# EAGLE design deBug (EAGLE 6.5.0)
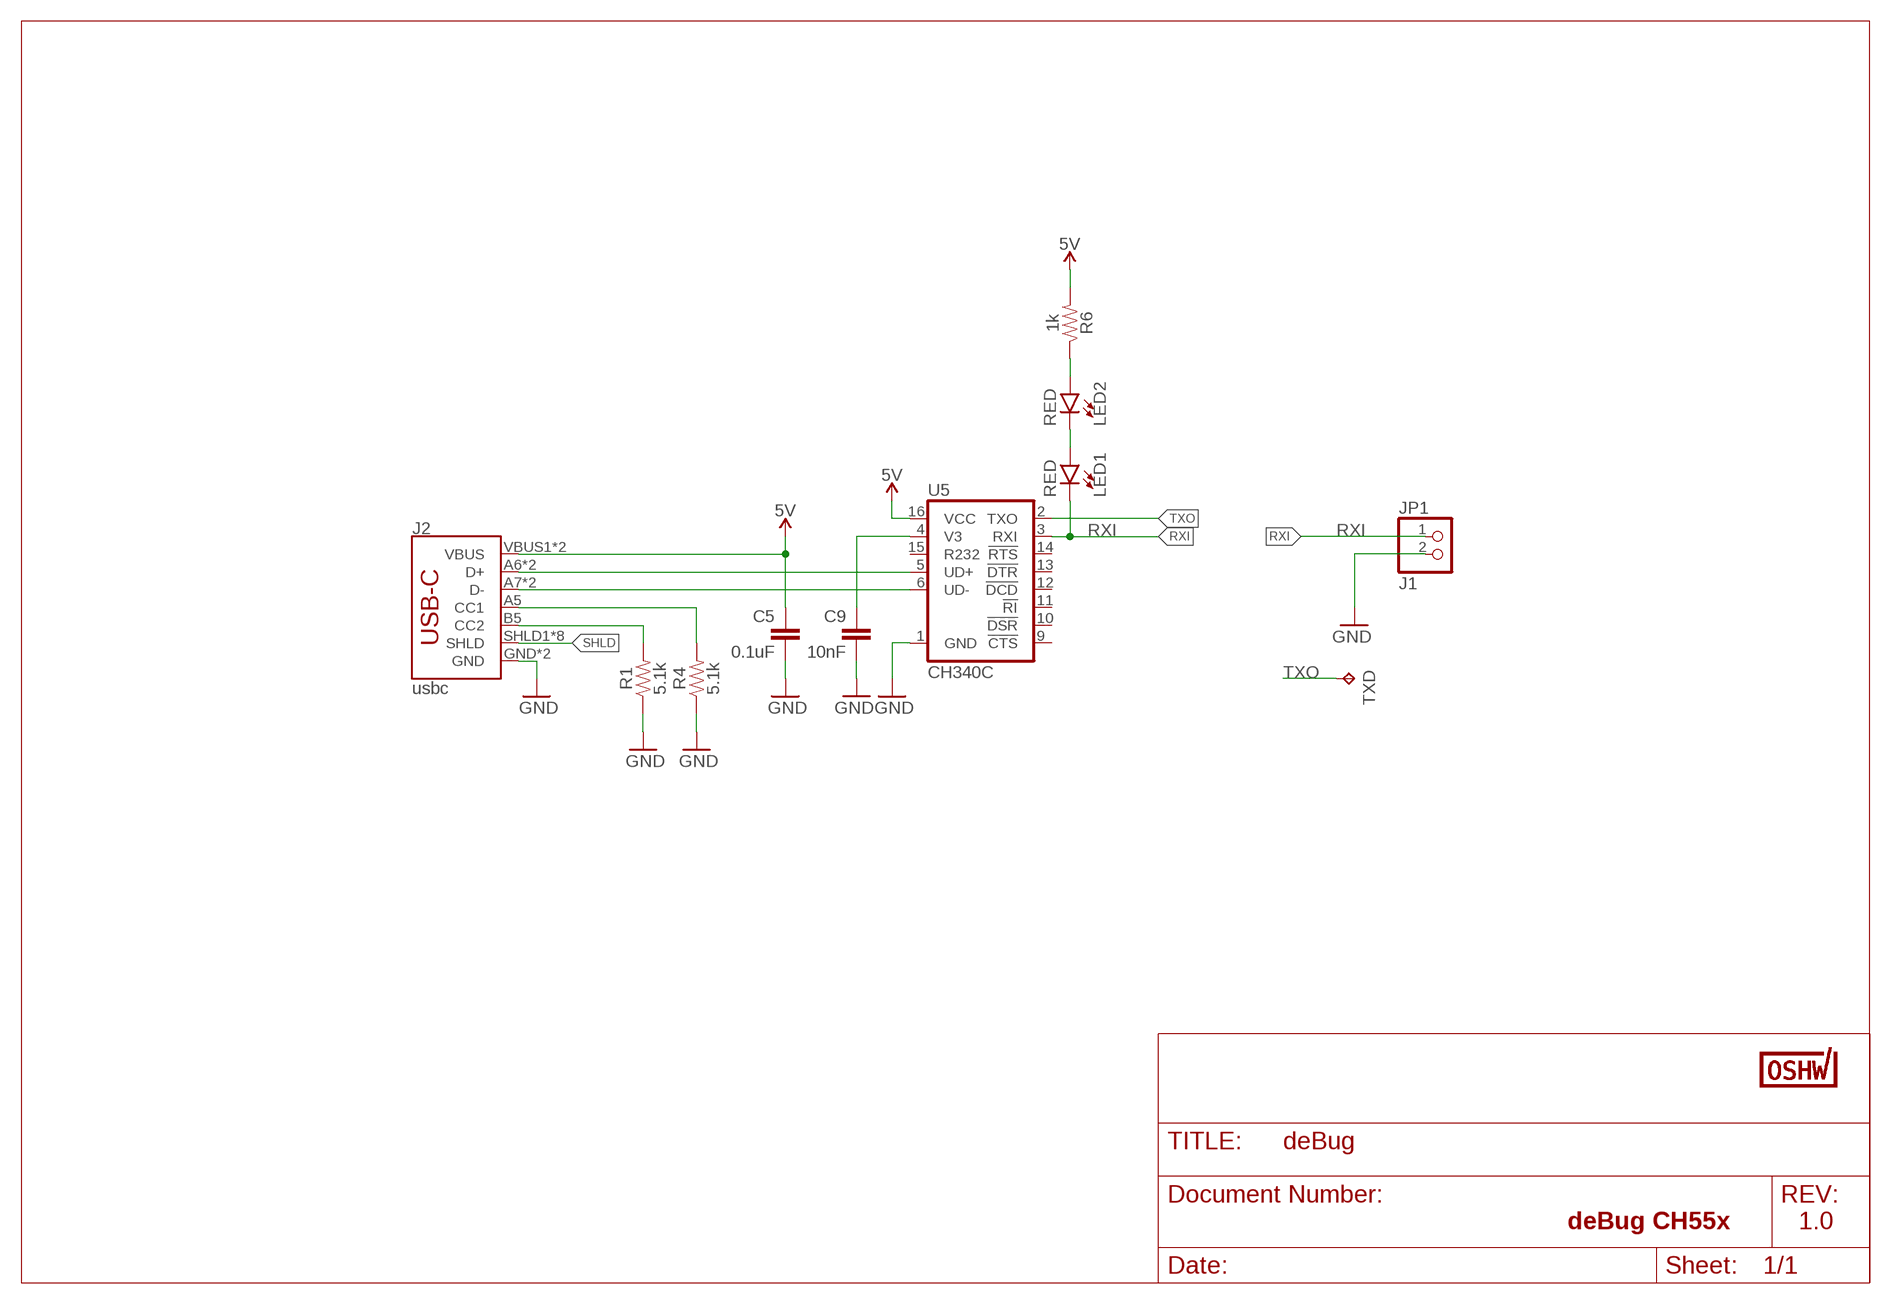
[diagram p0: schematic, sheet 1]

## Parts
C5  0.1uF  0.1UF-0603-25V-(+80/-20%)  [0603]
C9  10nF  10NF-0603-50V-10%  [0603]
J2  usbc  USB_C16PIN  [USB-C-16P]
JP1  J1  PINHD-1X2  [1X02]
LED1  RED  LED-GREEN0603  [LED-0603]
LED2  RED  LED-GREEN0603  [LED-0603]
R1  5.1k  5.1KOHM5.1KOHM-0603-1/10W-1%  [0603]
R4  5.1k  5.1KOHM5.1KOHM-0603-1/10W-1%  [0603]
R6  1k  1KOHM-0603-1/10W-1%  [0603]
TXD  TPB1,27  [B1,27]
U5  CH340C  [SO016]
U$2  CERT-LARGE  [CERT-LARGE-SILK]

## Nets
5V: C5.1 J2.VBUS1(VBUS) J2.VBUS2(VBUS) R6.2 U5.16(VCC)
CC1: J2.A5(CC1) R4.2
CC2: J2.B5(CC2) R1.2
D+: J2.A6(D+) J2.B6(D+) U5.5(UD+)
D-: J2.A7(D-) J2.B7(D-) U5.6(UD-)
GND [power]: C5.2 C9.2 J2.GND J2.GND2(GND) JP1.2 R1.1 R4.1 U5.1(GND)
N$1: C9.1 U5.4(V3)
N$3: LED2.A R6.1
N$4: LED1.A LED2.C
RXI: JP1.1 LED1.C U5.3(RXI)
SHLD: J2.SHLD1(SHLD) J2.SHLD2(SHLD) J2.SHLD3(SHLD) J2.SHLD4(SHLD) J2.SHLD5(SHLD) J2.SHLD6(SHLD) J2.SHLD7(SHLD) J2.SHLD8(SHLD)
TXO: TXD.TP U5.2(TXO)
Unconnected: U5.9(!CTS) U5.10(!DSR) U5.11(!RI) U5.12(!DCD) U5.13(!DTR) U5.14(!RTS) U5.15(R232)

## Notes on the sheet
- deBug CH55x | 1.0

## Library data of the parts
C5 = SparkFun-Capacitors:0.1UF: 0.1µF ceramic capacitors A capacitor is a passive two-terminal electrical component used to store electrical energy temporarily in an electric field.; PROD_ID: CAP-00810
C9 = SparkFun-Capacitors:10NF: 0.01uF/10nF/10,000pF ceramic capacitors A capacitor is a passive two-terminal electrical component used to store electrical energy temporarily in an electric field. CAP-09321; PROD_ID: CAP-00867
J2 = SparkFun-Connectors:USB_C: USB Type C 16Pin Connector Super Speed pins not available on the 16-pin purely SMD connector so this part is best for USB 2.0 implementations. D1 and D2 are tied together enabling D+/- no matter which way the cable is plugged into the connector. The two channel configuration pins (CC1/2) are exposed. These are normally connected to ground via 5.1k resistors but can be reconfigured for high current/high power applications.; PROD_ID: CONN-14122
JP1 = pinhead:PINHD-1X2: PIN HEADER
LED1 LED2 = SparkFun-LED:LED-GREEN: Green SMD LED Used in manufacturing of various products at SparkFun Packages: 0603 - SMD 0603 package [Product Link] <http://www.futureelectronics.com/en/technologies/semiconductors/optoelectronics/leds/Pages/9894312-LTST-C190GKT.aspx?CrossPart=HSMG-C190&IM=0> LilyPad 1206 - SMD1206 LilyPad package [Product Link] <http://www.futureelectronics.com/en/Technologies/Product.aspx?ProductID=IN150NGHARVATEKCORPORATION2049943&IM=0> 1206 - SMD1206 package [Product Link] <http://www.futureelectronics.com/en/technologies/semiconductors/optoelectronics/leds/Pages/8315665-LTST-C150KGKT.aspx?IM=0> 1206 Bottom Mount -SMD 1206 Bottom Mount [Product Link] <http://www.digikey.com/product-detail/en/lite-on-inc/LTST-C230KGKT/160-1456-1-ND/386854> SparkFun Products: Pro Mini 328 -5V <https://www.sparkfun.com/products/821> RedBoard <https://www.sparkfun.com/products/12757> MP3 Trigger <https://www.sparkfun.com/products/13720> Makey Makey <https://www.sparkfun.com/products/11076>; PROD_ID: DIO-00821; VALUE: GREEN
R1 R4 = SparkFun-Resistors:5.1KOHM; PROD_ID: RES-12083
R6 = SparkFun-Resistors:1KOHM: 1kΩ resistor A resistor is a passive two-terminal electrical component that implements electrical resistance as a circuit element. Resistors act to reduce current flow, and, at the same time, act to lower voltage levels within circuits. - Wikipedia; PROD_ID: RES-07856
TXD = testpad:TP: Test pad
U5 = SparkFun-IC-Comms:CH340C; PROD_ID: IC-14038
U$2 = OSHWA:CERT

## Net classes
1 power: width 0.178 mm

## Board
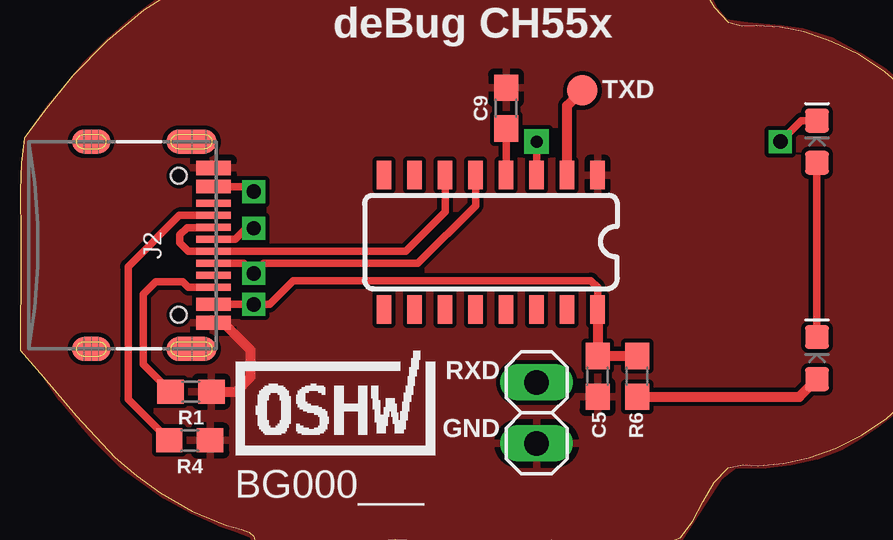
[diagram p1: board, top side]
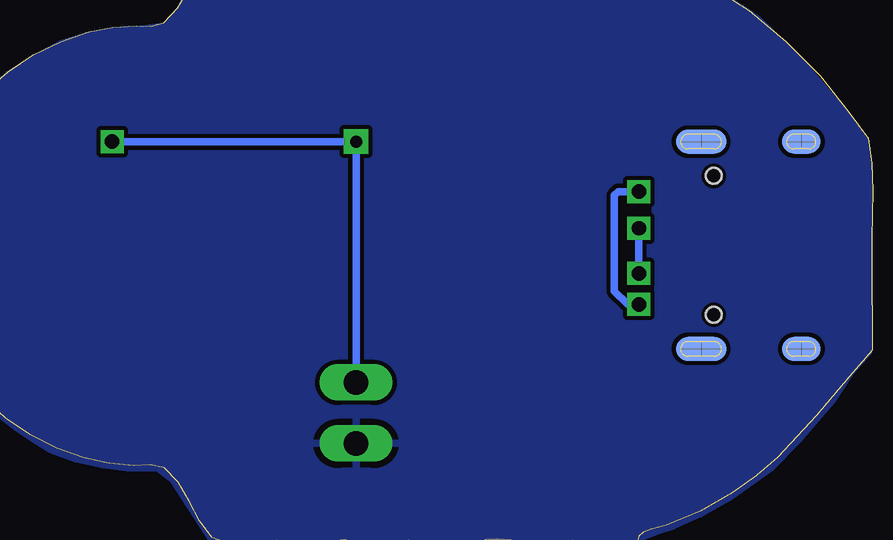
[diagram p2: board, bottom side, seen from below]

No outline drawn. Coordinates in mm, seen from the top.
Copper layers (1*16): Top 0.035mm / dielectric 1.5mm / Bottom 0.035mm
Design rules "SparkFun-2-layer-TIGHT *": minimum track width 7mil, minimum drill 15mil, track to track 7mil, track to pad 7mil, pad to pad 7mil, via to via 7mil, smd to smd 7mil, copper to edge 7mil, drill to drill 7mil, minimum pad ring 7mil, minimum via ring 7mil, stop-mask expansion 4mil, vias tented up to drill 25mil, thermal gap 10mil
Holes 2.8 mm at 48.39,32.64
Milling: 319 lines

### Footprints (pad centres in the part's own frame; a part is rotated, then mirrored left to right if it is on the bottom)
0603 = smd 1.1 x 1: 1 -0.85,0; 2 0.85,0
USB-C-16P = smd 0.3 x 1.45: A5 -1.25,0; A6 -0.25,0; A7 0.25,0; A8 1.25,0; B5 1.75,0; B6 0.75,0; B7 -0.75,0; B8 -1.75,0 | smd 0.6 x 1.45: GND -3.225,0; GND2 3.225,0 | smd 1 x 2.1: SHLD1 -4.32,-0.915; SHLD2 4.32,-0.915 | smd 1 x 2.1 bottom: SHLD3 -4.32,-0.915; SHLD4 4.32,-0.915 | smd 1 x 1.6: SHLD5 -4.32,-5.095; SHLD8 4.32,-5.095 | smd 1 x 1.6 bottom: SHLD6 -4.32,-5.095; SHLD7 4.32,-5.095 | smd 0.55 x 1.45: VBUS1 -2.45,0; VBUS2 2.45,0 | hole 0.65: -2.89,-1.445; 2.89,-1.445
1X02 = drill 1.016 long: 1 -1.27,0; 2 1.27,0
LED-0603 = smd 1 x 1: A -0.877,0; C 0.877,0
B1,27 = smd 1.27 x 1.27: TP 0,0
SO016 = smd 0.6 x 1.2: 1 -4.445,-2.8; 2 -3.175,-2.8; 3 -1.905,-2.8; 4 -0.635,-2.8; 5 0.635,-2.8; 6 1.905,-2.8; 7 3.175,-2.8; 8 4.445,-2.8; 9 4.445,2.8; 10 3.175,2.8; 11 1.905,2.8; 12 0.635,2.8; 13 -0.635,2.8; 14 -1.905,2.8; 15 -3.175,2.8; 16 -4.445,2.8

### Placement (x,y rotation side)
C5  34.04,27.18 270 top
C9  30.23,38.35 90 top
J2  18.03,32.64 270 top
JP1  31.5,25.65 270 top
LED1  43.18,36.96 90 top
LED2  43.18,27.94 90 top
R1  17.09,26.54 180 top
R4  17.04,24.51 180 top
R6  35.69,27.18 90 top
TXD  33.4,39.09 0 top
U5  29.59,32.77 180 top
U$1  [CERT-SMALL-SILK]  23.11,23.9 0 top
U$2  8.05,-27.99 0 top

### Tracks (layer width: path | path; a pad name or v marks a point on that pad's centre or on a via)
5V  (via drill 0.6)
  Top 0.305: J2.VBUS1 18.05,35.08 19.51,35.08 v19.71,34.87 | U5.16 34.04,30.89 33.76,31.17 21.36,31.17 20.37,30.18 v19.71,30.18 19.7,30.19 J2.VBUS2
  Top 0.406: U5.16 C5.1 R6.2
  Bottom 0.305: v19.71,30.18 20.17,30.18 20.73,30.73 20.73,34.72 20.57,34.87 v19.71,34.87
CC1
  Top 0.305: J2.A5 16.62,33.89 14.48,31.75 14.48,26.23 R4.2
CC2
  Top 0.305: J2.B5 16.99,30.89 16.76,31.11 15.62,31.11 15.11,30.61 15.11,27.67 R1.2
D+  (via drill 0.6)
  Top 0.305: U5.5 28.96,34.29 26.55,31.89 20.13,31.89 v19.71,31.47 19.29,31.89 J2.B6 | v19.71,33.35 19.41,33.35 18.95,32.89 J2.A6
  Bottom 0.305: v19.71,31.47 v19.71,33.35
D-
  Top 0.305: U5.6 27.69,34.04 26.04,32.39 J2.A7 16.99,32.39 16.64,32.74 16.64,33.07 16.94,33.38 18.02,33.38 J2.B7
GND
  Top 0.406: J2.GND2 18.44,29.41 19.58,28.27 19.58,27.15 18.97,26.54 R1.1
  pour Top: 19.43,44.58 18.03,44.07 16.26,43.18 14.73,42.04 13.72,41.15 12.7,40.13 11.3,38.48 10.29,37.08 10.16,35.81 10.16,28.32 10.92,27.43 11.68,26.29 12.45,25.4 13.08,24.64 14.22,23.5 16,22.23 17.14,21.59 18.29,21.08 19.05,20.83 19.68,20.57 19.81,20.19 19.81,19.68 19.68,18.41 19.68,18.03 19.18,17.91 17.4,18.03 16.26,17.78 15.49,17.27 11.56,13.08 11.3,12.57 11.3,12.06 11.43,11.68 11.81,11.43 12.32,11.3 12.83,11.43 13.34,11.68 17.14,15.49 17.78,15.62 21.97,15.62 22.1,16.51 22.1,20.07 22.35,20.32 26.16,20.32 26.54,20.19 26.54,17.02 26.42,16.51 22.1,11.81 21.72,11.05 21.72,10.41 22.1,10.03 22.73,9.78 23.37,10.03 28.7,15.62 28.83,16.51 28.83,19.68 28.96,20.32 30.99,20.19 32.26,20.32 32.13,17.53 32.13,16.13 37.59,12.57 38.35,12.32 38.99,12.32 39.37,12.83 39.5,13.46 39.24,14.1 38.61,14.61 34.42,17.27 34.42,20.07 34.8,20.32 36.96,20.32 37.47,20.45 39.12,22.99 39.75,23.5 41.02,23.5 42.04,23.62 43.18,23.88 44.2,24.26 44.83,24.64 45.59,25.15 47.24,26.42 48.26,27.56 48.77,28.19 49.4,28.19 51.69,27.18 53.59,26.04 54.99,24.89 56.13,23.37 56.9,21.84 57.53,21.08 58.04,20.95 58.42,20.95 58.93,21.21 59.05,21.59 59.05,22.23 58.29,23.75 57.28,25.15 56.39,26.16 55.37,27.18 54.23,28.07 52.45,29.08 49.91,30.1 50.67,31.37 50.93,31.88 51.05,32.64 50.93,33.4 50.42,34.42 49.91,35.18 52.07,35.94 53.47,36.7 55.12,37.85 56.26,38.86 57.02,39.75 57.91,40.77 58.55,41.78 58.93,42.67 59.05,43.31 59.05,43.69 58.8,44.07 58.29,44.32 57.91,44.32 57.53,44.07 56.9,43.43 56.01,41.78 54.74,40.26 53.47,38.99 51.69,38.1 50.55,37.59 49.28,37.08 48.77,37.08 48.26,37.59 47.12,38.86 46.86,39.12 45.97,39.88 44.96,40.51 43.81,41.15 42.55,41.53 41.66,41.66 40.26,41.78 39.37,41.91 38.86,42.55 38.1,44.07 37.34,44.83 36.96,44.96 34.42,44.96 34.29,45.34 34.29,45.97 34.42,47.62 34.67,48.13 36.07,49.02 38.99,50.8 39.37,51.31 39.5,52.07 39.24,52.58 38.73,52.83 38.1,52.83 37.72,52.7 32.26,49.15 32.13,48.26 32.13,44.96 28.96,44.96 28.7,45.34 28.83,49.15 28.57,49.91 23.37,55.24 22.86,55.37 22.35,55.37 21.72,54.74 21.72,54.1 22.1,53.21 26.54,48.64 26.54,45.21 26.42,44.96 26.04,44.83 22.61,44.83 22.1,45.09 21.97,45.59 21.97,49.53 17.27,49.53 12.95,53.85 12.19,53.85 11.56,53.59 11.3,53.09 11.3,52.45 11.68,51.94 15.24,48.39 16,47.5 16.64,47.24 19.68,47.24 19.81,46.86 19.81,44.83
  pour Bottom: 19.43,44.45 18.03,43.94 16.26,43.05 14.73,42.04 12.7,40.01 11.3,38.35 10.29,36.96 10.16,35.69 10.16,28.19 10.92,27.3 11.68,26.16 12.45,25.27 13.08,24.51 14.22,23.37 16,22.1 17.14,21.46 18.29,20.95 19.05,20.7 19.68,20.45 19.81,20.07 19.81,19.56 19.68,18.29 19.68,17.91 19.18,17.78 17.4,17.91 16.26,17.65 15.49,17.14 11.56,12.95 11.3,12.45 11.3,11.94 11.43,11.56 11.81,11.3 12.32,11.18 12.83,11.3 13.34,11.56 17.14,15.37 17.78,15.49 21.97,15.49 22.1,16.38 22.1,19.94 22.35,20.19 26.16,20.19 26.54,20.07 26.54,16.89 26.42,16.38 22.1,11.68 21.72,10.92 21.72,10.29 22.1,9.91 22.73,9.65 23.37,9.91 28.7,15.49 28.83,16.38 28.83,19.56 28.96,20.19 30.99,20.07 32.26,20.19 32.13,17.4 32.13,16 37.59,12.45 38.35,12.19 38.99,12.19 39.37,12.7 39.5,13.34 39.24,13.97 38.61,14.48 34.42,17.14 34.42,19.94 34.8,20.19 36.96,20.19 37.47,20.32 39.12,22.86 39.75,23.37 41.02,23.37 42.04,23.5 43.18,23.75 44.2,24.13 44.83,24.51 45.59,25.02 47.24,26.29 48.26,27.43 48.77,28.07 49.4,28.07 51.69,27.05 53.59,25.91 54.99,24.77 56.13,23.24 56.9,21.72 57.53,20.95 58.04,20.83 58.42,20.83 58.93,21.08 59.05,21.46 59.05,22.1 58.29,23.62 57.28,25.02 56.39,26.04 55.37,27.05 54.23,27.94 52.45,28.96 49.91,29.97 50.67,31.24 50.93,31.75 51.05,32.51 50.93,33.27 50.42,34.29 49.91,35.05 52.07,35.81 53.47,36.58 55.12,37.72 56.26,38.73 57.02,39.62 57.91,40.64 58.55,41.66 58.93,42.55 59.05,43.18 59.05,43.56 58.8,43.94 58.29,44.2 57.91,44.2 57.53,43.94 56.9,43.31 56.01,41.66 54.74,40.13 53.47,38.86 51.69,37.97 50.55,37.47 49.28,36.96 48.77,36.96 48.26,37.47 47.12,38.73 46.86,38.99 45.97,39.75 44.96,40.39 43.81,41.02 42.55,41.4 41.66,41.53 40.26,41.66 39.37,41.78 38.86,42.42 38.1,43.94 37.34,44.7 36.96,44.83 34.42,44.83 34.29,45.21 34.29,45.85 34.42,47.5 34.67,48.01 36.07,48.9 38.99,50.67 39.37,51.18 39.5,51.94 39.24,52.45 38.73,52.7 38.1,52.7 37.72,52.58 32.26,49.02 32.13,48.13 32.13,44.83 28.96,44.83 28.7,45.21 28.83,49.02 28.57,49.78 23.37,55.12 22.86,55.24 22.35,55.24 21.72,54.61 21.72,53.98 22.1,53.09 26.54,48.51 26.54,45.09 26.42,44.83 26.04,44.7 22.61,44.7 22.1,44.96 21.97,45.47 21.97,49.4 17.27,49.4 12.95,53.72 12.19,53.72 11.56,53.47 11.3,52.96 11.3,52.32 11.68,51.82 15.24,48.26 16,47.37 16.64,47.12 19.68,47.12 19.81,46.74 19.81,44.7
N$1
  Top 0.305: C9.1 U5.4
N$3
  Top 0.406: R6.1 42.45,26.33 LED2.A
N$4
  Top 0.305: LED2.C LED1.A
RXI  (via drill 0.5 pad 1.02, 0.6)
  Top 0.305: LED1.C 42.53,37.83 v41.66,36.96 | v31.5,36.96 U5.3
  Bottom 0.305: v41.66,36.96 v31.5,36.96 JP1.1
TXO
  Top 0.406: U5.2 32.77,38.46 TXD.TP

### Text on the board
tNames: deBug CH55x | RXD | GND
Measures: All dimensions in inches